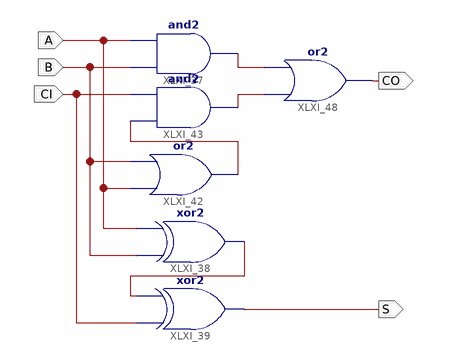
[diagram p0: schematic sheet 1]
// Xilinx ISE schematic FA.sch (spartan3) as structural Verilog: 6 symbols, 5 ports
module FA (
  input  B,
  input  CI,
  input  A,
  output S,
  output CO
);

  wire XLXN_72, XLXN_90, XLXN_105, XLXN_106;

  xor XLXI_38 (XLXN_72, B, A);
  xor XLXI_39 (S, CI, XLXN_72);
  or XLXI_42 (XLXN_90, A, B);
  and XLXI_37 (XLXN_105, B, A);
  and XLXI_43 (XLXN_106, XLXN_90, CI);
  or XLXI_48 (CO, XLXN_106, XLXN_105);
endmodule
